# Altium schematic sheet 14_FAN_RTC.SchDoc
size 297 x 209 mm
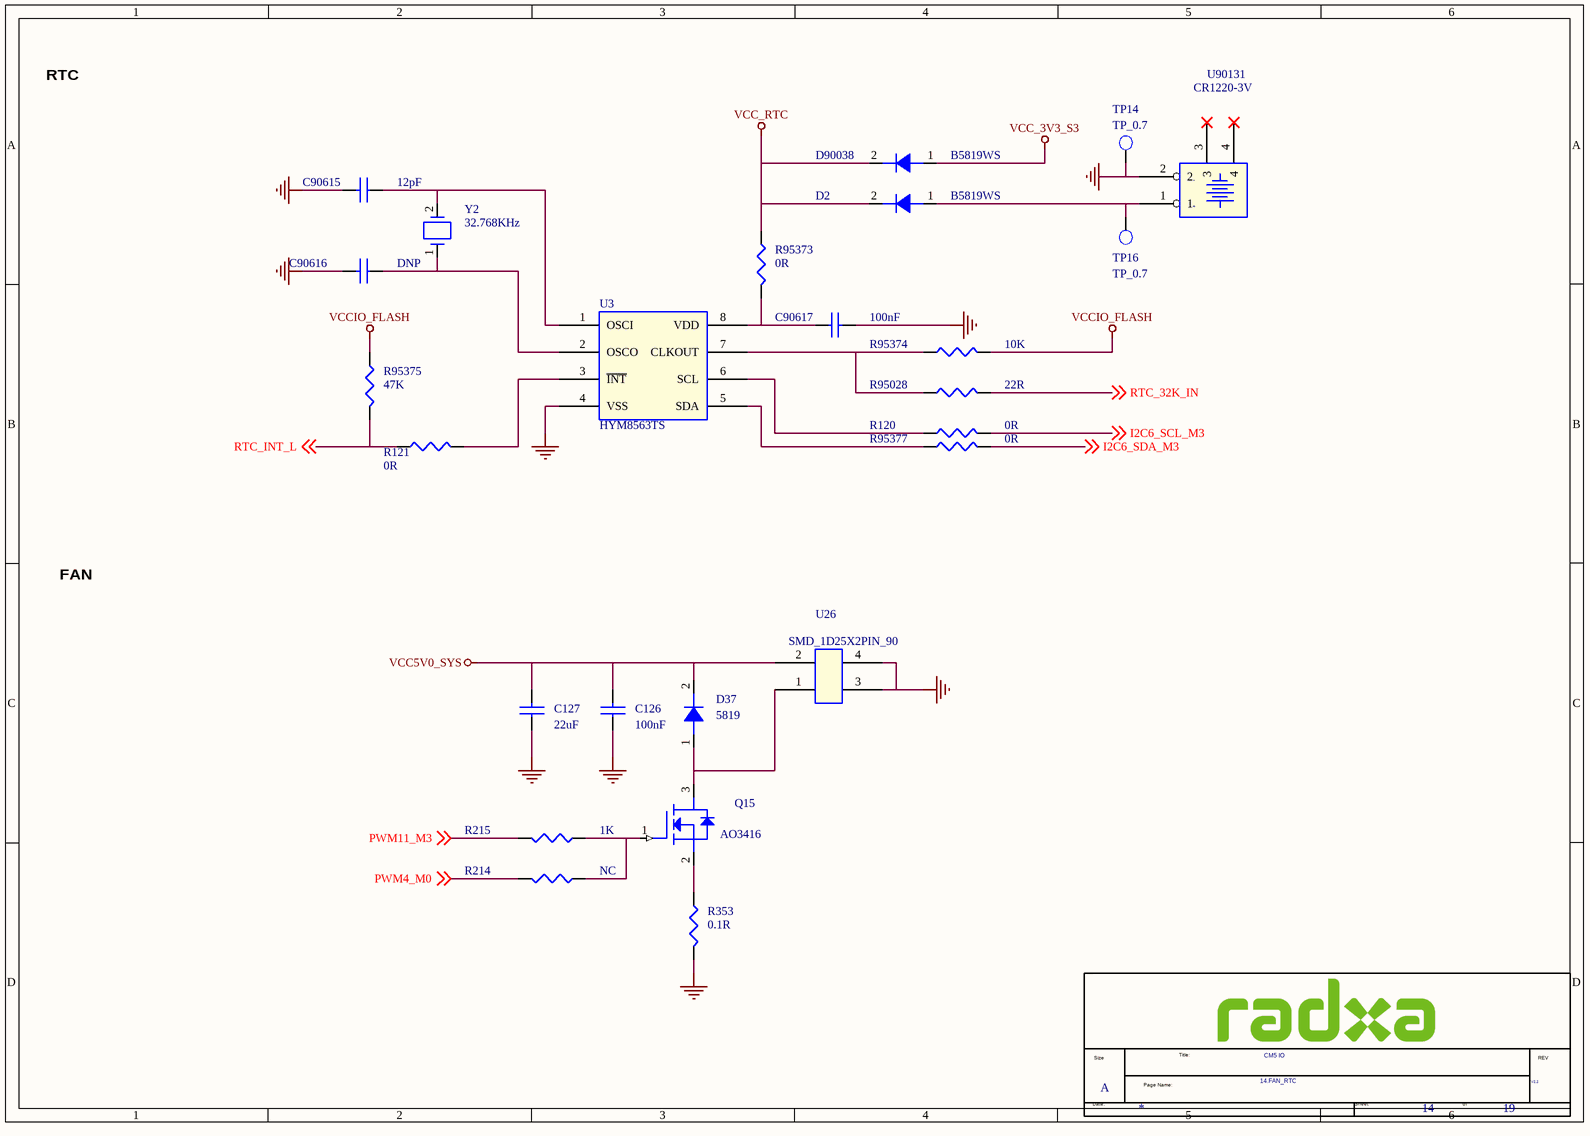
[diagram p0: 14_FAN_RTC.SchDoc]

## Parts
*  Doc: 14.FAN_RTC  RevCode: V2.2  Title: CM5 IO  Page Size: A  Page Number: 14  Page Count: 19  (hidden comment: radxa_1010)  (graphical)
C126  100nF  [C0402]
C127  22uF  [C0603]
C90615  12pF  [C0402]
C90616  DNP  [C0402]
C90617  100nF  [C0402]
D2  B5819WS  [SOD_323]
D37  5819  [SOD_123]
D90038  B5819WS  [SOD_323]
Q15  AO3416  [SOT23]
R120  0R  [R0402]
R121  0R  [R0402]
R214  NC  [R0402]
R215  1K  [R0402]
R353  0.1R  [R0402]
R95028  22R  [R0402]
R95373  0R  [R0402]
R95374  10K  [R0402]
R95375  47K  [R0402]
R95377  0R  [R0402]
TP14  TP_0.7  [TEST]
TP16  TP_0.7  [TEST]
U3  HYM8563TS  [TSSOP8_3R10X3R10X1R10]
U26  SMD_1D25X2PIN_90  [SMD_1D25X2PIN_90]
U90131  CR1220-3V  [BATTERY-20MM]
Y2  32.768KHz  [3215_2pin]

## Nets
GND: C126.1 C127.1 C90615.2 C90616.2 C90617.2 R353.2 TP14.1 U3.4(VSS) U26.3 U26.4 U90131.2
VCC5V0_SYS: C126.2 C127.2 D37.2(K) U26.2
VCC_3V3_S3: D90038.1(A)
VCC_RTC: D2.2(K) D90038.2(K) R95373.1
VCCIO_FLASH: R95374.2 R95375.1
I2C6_SCL_M3: R120.2 ; off-sheet I2C6_SCL_M3
I2C6_SDA_M3: R95377.2 ; off-sheet I2C6_SDA_M3
PWM4_M0: R214.2 ; off-sheet PWM4_M0
PWM11_M3: R215.2 ; off-sheet PWM11_M3
RTC_32K_IN: R95028.2 ; off-sheet RTC_32K_IN
RTC_INT_L: R121.1 R95375.2 ; off-sheet RTC_INT_L
NetC90615_1: C90615.1 U3.1(OSCI) Y2.2
NetC90616_1: C90616.1 U3.2(OSCO) Y2.1
NetC90617_1: C90617.1 R95373.2 U3.8(VDD)
NetD2_1: D2.1(A) TP16.1 U90131.1
NetD37_1: D37.1(A) Q15.3(DRAIN) U26.1
NetQ15_1: Q15.1(GATE) R214.1 R215.1
NetQ15_2: Q15.2(SOURCE) R353.1
NetR120_1: R120.1 U3.6(SCL)
NetR121_2: R121.2 U3.3(~{INT})
NetR95028_1: R95028.1 R95374.1 U3.7(CLKOUT)
NetR95377_1: R95377.1 U3.5(SDA)

Not connected (* = marked no-connect by the designer): U90131 3* 4*

## Notes on the sheet
- RTC
- FAN
- (in symbol CON_BATTERY-20MM_0) -; +
- (in symbol radxa_1010) Size; Title:; REV; Page Name:; Date:; Sheet; of

## Library data of the parts
C126 = CAP NP_0: cap,100.00nF,+/-10%,16V,X5R,C0402; Manufacturer PN: C1005X5R1C104K050BA; Manufacturer: TDK; Voltage: 25V; Tolerance: 10%; Priority: A; PCB Footprint: C0402; Dielectric: X5R; Created by: JJJ; Part Type: C0402; RK PN: C1005X5R1C104K050BA
C127 = CAP NP_0: cap,22.00uF,+/-10%,10V,X5R,C0805; Manufacturer: TDK; Voltage: 25V; RK PN: C2012X5R1A226K125AB; Priority: A; Tolerance: 10%; PCB Footprint: C0603; Dielectric: X5R; Part Type: C0805; Manufacturer PN: C2012X5R1A226K125AB; Created by: JJJ
C90615 = CAP NP_0: cap,12.00pF,+/-5%,50V,C0G,C0402; Manufacturer: TDK; RK PN: C1005C0G1H120J050BA; Priority: A; Tolerance: 5%; Voltage: 50V; PCB Footprint: C0402; Dielectric: C0G; Part Type: C0402; Manufacturer PN: C1005C0G1H120J050BA; Created by: JJJ
C90616 = CAP NP_0: Did Not Place.; Manufacturer PN: DNPC0402; Priority: A; PCB Footprint: C0402; Created by: JJJ; Part Type: DNP; RK PN: DNPC0402
C90617 = CAP NP_0: cap,100.00nF,+/-10%,16V,X5R,C0402; Manufacturer PN: C1005X5R1C104K050BA; Manufacturer: TDK; C_Voltage: 6.3V; Tolerance: 10%; Priority: A; Number: 37; Voltage: 16V; PCB Footprint: C0402; Dielectric: X5R; Created by: JJJ; Part Type: C0402; RK PN: C1005X5R1C104K050BA
D2 D37 D90038 = DIODE_Dup1: Schottky Barrier，B5819WS SOD-323; Manufacturer: 长电; Priority: A; Created by: JJJ; Manufacturer PN: B5819WS; Part Type: Schottky rectifier; RK PN: B5819WS
  D2 D90038: PCB Footprint: SOD_323
  D37: PCB Footprint: SOD_123
Q15 = MOSFET N: MOSFET-N,WNM3003 ,30V,+/-20V,4.0A,33m Ohm@Vgs=10V,43m Ohm@Vgs=4.5V,SOT23; PCB Footprint: SOT23
R120 R121 = RESISTOR_1: 通用厚膜电阻,0R,+/-5%,R0402,1/16W.; Manufacturer: YAGEO; Tolerance: 5%; RK PN: RC0402JR-070RL; Priority: A; Wattage: 1/16W; PCB Footprint: R0402; Part Type: 通用厚膜电阻; Manufacturer PN: RC0402JR-070RL; Created by: YTL
R214 R95375 = RESISTOR_1: 通用厚膜电阻,47K,+/-5%,R0402,1/16W.; Manufacturer: YAGEO; Tolerance: 5%; RK PN: RC0402JR-0747KL; Priority: A; Wattage: 1/16W; PCB Footprint: R0402; Part Type: 通用厚膜电阻; Manufacturer PN: RC0402JR-0747KL; Created by: YTL
R215 = RESISTOR_1: 通用厚膜电阻,47K,+/-5%,R0402,1/16W.; Manufacturer PN: RC0402JR-0747KL; Manufacturer: YAGEO; Tolerance: 5%; Wattage: 1/16W; Priority: A; PCB Footprint: R0402; Created by: YTL; Part Type: 通用厚膜电阻; RK PN: RC0402JR-0747KL
R353 = RESISTOR_0: 通用厚膜电阻,10K,+/-5%,R0402,1/16W.; Manufacturer PN: RC0402JR-0710KL; Manufacturer: YAGEO; PCB Footprint: R1206; Tolerance: 5%; Wattage: 1/16W; Priority: A; Created by: YTL; Part Type: 通用厚膜电阻; RK PN: RC0402JR-0710KL
R95028 = RESISTOR_1: 通用厚膜电阻,10K,+/-5%,R0402,1/16W.; Manufacturer PN: RC0402JR-0710KL; Manufacturer: YAGEO; Tolerance: 5%; Wattage: 1/16W; Priority: A; PCB Footprint: R0402; Created by: YTL; Part Type: 通用厚膜电阻; RK PN: RC0402JR-0710KL
R95373 = RESISTOR_1: 通用厚膜电阻,0R,+/-1%,R0603,1/10W.; Manufacturer PN: RC0603FR-070RL; Manufacturer: YAGEO; Tolerance: 1%; Wattage: 1/10W; Priority: A; PCB Footprint: R0603; Created by: YTL; Part Type: 通用厚膜电阻; RK PN: RC0603FR-070RL
R95374 = RESISTOR_1: 通用厚膜电阻,10K,+/-5%,R0402,1/16W.; Manufacturer: YAGEO; Tolerance: 5%; RK PN: RC0402JR-0710KL; Priority: A; Wattage: 1/16W; PCB Footprint: R0402; Part Type: 通用厚膜电阻; Manufacturer PN: RC0402JR-0710KL; Created by: YTL
R95377 = RESISTOR_1: 通用厚膜电阻,0R,+/-5%,R0402,1/16W.; Manufacturer PN: RC0402JR-070RL; Manufacturer: YAGEO; Tolerance: 5%; Wattage: 1/16W; Priority: A; PCB Footprint: R0402; Created by: YTL; Part Type: 通用厚膜电阻; RK PN: RC0402JR-070RL
TP14 = TP: Test Point 0.7mm; PCB Footprint: TP_0R70; RK PN: TESTPOINT_0R7; Priority: A; Part Type: TP; Created by: JJJ
TP16 = TP: Test Point 0.7mm; PCB Footprint: TP_0R70; Priority: A; RK PN: TESTPOINT_0R7; Created by: JJJ; Part Type: TP
U3 = RTC_HYM8563: I2C Real Time Clock/Calendar; Manufacturer: Haoyu（昊昱微电子）; Priority: A; PCB Footprint: TSSOP8_3R10X3R10X1R10; Created by: JJJ; Manufacturer PN: HYM8563TS; Part Type: RTC; RK PN: HYM8563TS
U26 = CON3_6: PCB Footprint: SMD_1D25X2PIN_90
U90131 = CON_BATTERY-20MM_0: PCB Footprint: BAT_CR1220
Y2 = CRYSTAL_2P: 无源晶振，32.768KHz,±20ppm，12.5pF; Manufacturer: TKD(泰晶); RK PN: SF-3215; Priority: A; PCB Footprint: 3215_2pin; Part Type: CRYSTAL; Manufacturer PN: SF-3215; Created by: YWQ
* = radxa_1010: Page Create Date: March  8, 1995; Page Modify Date: *